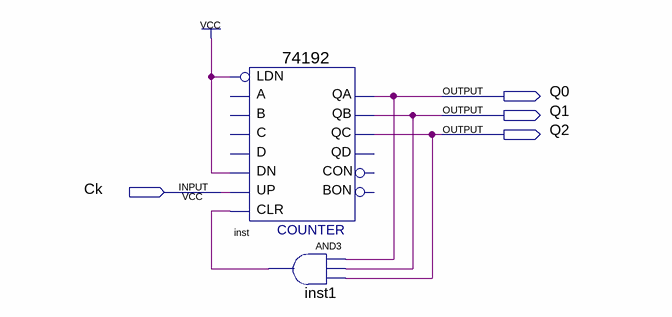
[diagram p0: schematic sheet]
// Quartus schematic 7_MOD_U_74192.bdf as structural Verilog: 2 symbols, 4 pins
module \7_MOD_U_74192  (
  input  Ck,
  output Q0,
  output Q1,
  output Q2
);

  wire inst1_out;

  \74192  inst (
    .CLR(inst1_out), .UP(Ck), .DN(1'b1), .LDN(1'b1), .QB(Q1), .QA(Q0), .QC(Q2));  // open: D, C, A, B, BON, CON, QD
  and inst1 (inst1_out, Q0, Q1, Q2);
endmodule
